# EAGLE design DC_Sensor_ESP8266_ADC_NC_10 (EAGLE 7.5.0)
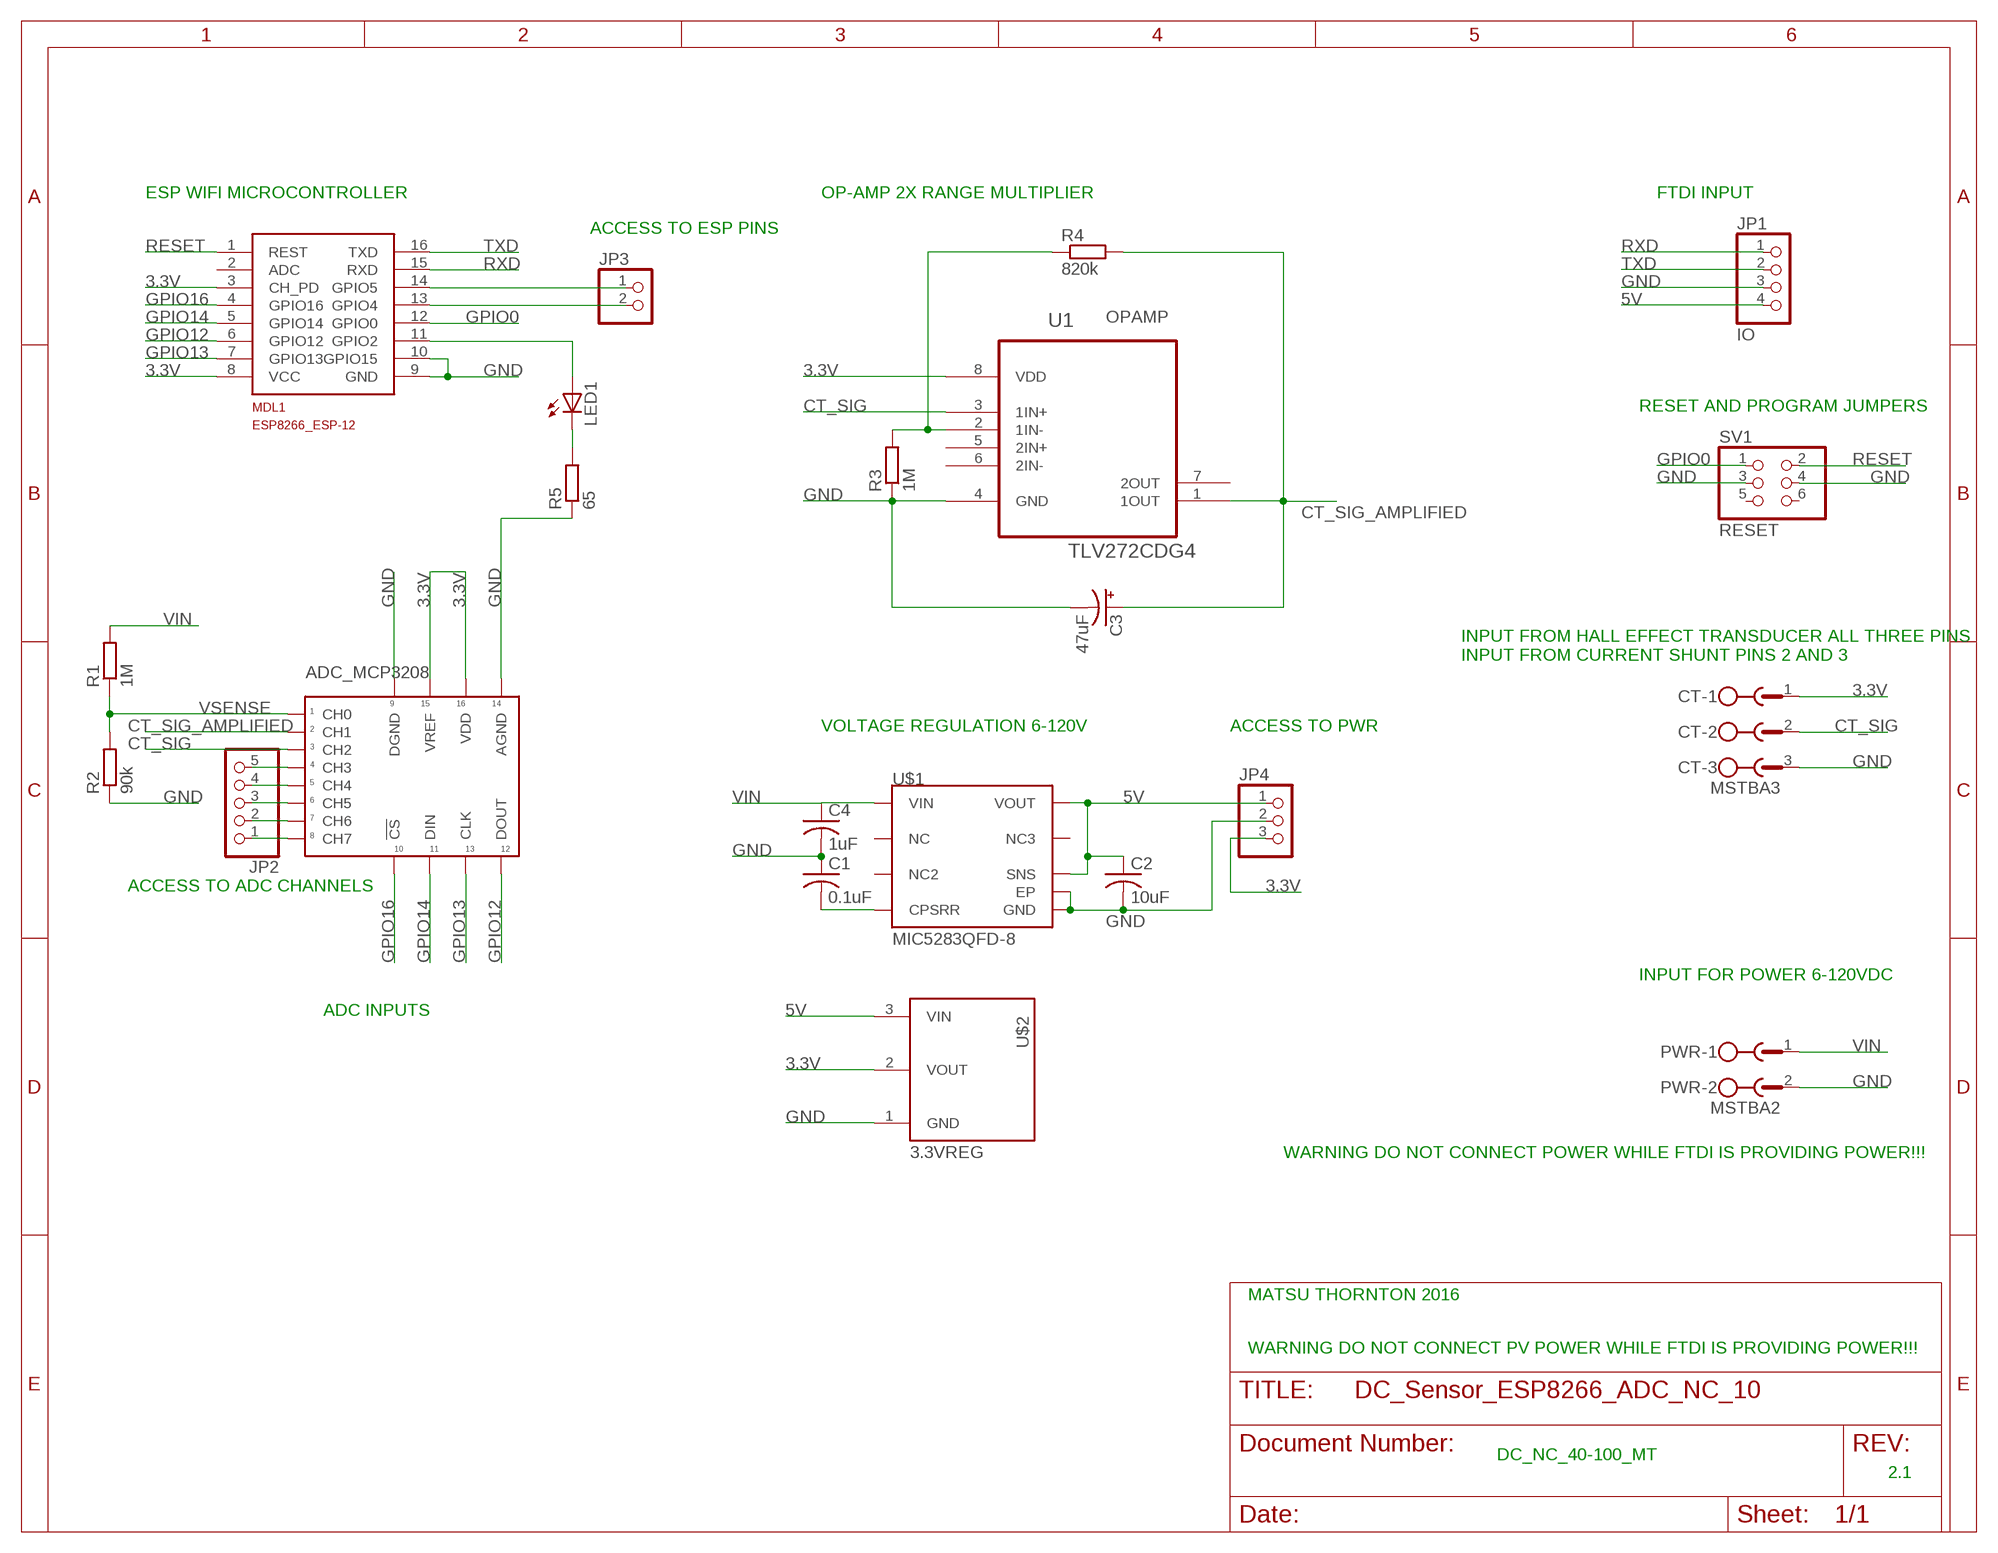
[diagram p0: schematic, sheet 1]

## Parts
ADC_MCP3208  21298ESMD  [PDIP16]
C1  0.1uF  C-USC0402  [C0402]
C2  10uF  C-USC0603K  [C0603K]
C3  47uF  CPOL-USC  [PANASONIC_C]
C4  1uF  C-USC2220K  [C2220K]
CT  MSTBA3  [MSTBA3]
JP1  IO  PINHD-1X4  [1X04]
JP2  PINHD-1X5  [1X05]
JP3  PINHD-1X2  [1X02]
JP4  PINHD-1X3  [1X03]
LED1  LEDCHIP-LED0603  [CHIP-LED0603]
MDL1  ESP8266-12GPIO04/05_CORRECTED  [ESP8266-ESP12]
PWR  MSTBA2  [MSTBA2]
R1  1M  R-EU_R0805  [R0805]
R2  90k  R-EU_R0805  [R0805]
R3  1M  R-EU_R0805  [R0805]
R4  820k  R-EU_R0805  [R0805]
R5  65  R-EU_R0805  [R0805]
SV1  RESET  PINHD-2X3  [2X03]
U1  TLV272CDG4  [SOIC127P600X175-8N]
U$1  MIC5283QFD-8  [8-VDFN]
U$2  3.3VREG  [3PVREG]

## Nets
3.3V: ADC_MCP3208.P$15(VREF) ADC_MCP3208.P$16(VDD) CT.1 JP4.3 MDL1.3(CH_PD) MDL1.8(VCC) U1.8(VDD) U$2.2(VOUT)
5V: C2.1 JP1.4 JP4.1 U$1.P$6(SNS) U$1.P$8(VOUT) U$2.3(VIN)
CT_SIG: ADC_MCP3208.P$3(CH2) CT.2 U1.3(1IN+)
CT_SIG_AMPLIFIED: ADC_MCP3208.P$2(CH1) C3.+ R4.2 U1.1(1OUT)
GND: ADC_MCP3208.P$9(DGND) ADC_MCP3208.P$14(AGND) C1.1 C2.2 C3.- C4.2 CT.3 JP1.3 JP4.2 MDL1.9(GND) MDL1.10(GPIO15) PWR.2 R2.1 R3.1 R5.1 SV1.3 SV1.4 U1.4(GND) U$1.EXP(EP) U$1.P$5(GND) U$2.1(GND)
GPIO0: MDL1.12(GPIO0) SV1.1
GPIO12: ADC_MCP3208.P$12(DOUT) MDL1.6(GPIO12)
GPIO13: ADC_MCP3208.P$13(CLK) MDL1.7(GPIO13)
GPIO14: ADC_MCP3208.P$11(DIN) MDL1.5(GPIO14)
GPIO16: ADC_MCP3208.P$10(!CS) MDL1.4(GPIO16)
N$1: LED1.A MDL1.11(GPIO2)
N$2: R3.2 R4.1 U1.2(1IN-)
N$3: LED1.C R5.2
N$4: C1.2 U$1.P$4(CPSRR)
N$7: JP3.1 MDL1.14(GPIO5)
N$8: JP3.2 MDL1.13(GPIO4)
N$9: ADC_MCP3208.P$4(CH3) JP2.5
N$10: ADC_MCP3208.P$5(CH4) JP2.4
N$11: ADC_MCP3208.P$6(CH5) JP2.3
N$12: ADC_MCP3208.P$7(CH6) JP2.2
N$13: ADC_MCP3208.P$8(CH7) JP2.1
RESET: MDL1.1(REST) SV1.2
RXD: JP1.1 MDL1.15(RXD)
TXD: JP1.2 MDL1.16(TXD)
VIN: C4.1 PWR.1 R1.2 U$1.P$1(VIN)
VSENSE: ADC_MCP3208.P$1(CH0) R1.1 R2.2
Unconnected: MDL1.2(ADC) SV1.5 SV1.6 U1.5(2IN+) U1.6(2IN-) U1.7(2OUT) U$1.P$2(NC) U$1.P$3(NC2) U$1.P$7(NC3)

## Notes on the sheet
- ESP WIFI MICROCONTROLLER | OP-AMP 2X RANGE MULTIPLIER | FTDI INPUT
- ACCESS TO ESP PINS
- RESET AND PROGRAM JUMPERS
- INPUT FROM HALL EFFECT TRANSDUCER ALL THREE PINS
  INPUT FROM CURRENT SHUNT PINS 2 AND 3
- VOLTAGE REGULATION 6-120V | ACCESS TO PWR
- ACCESS TO ADC CHANNELS
- INPUT FOR POWER 6-120VDC
- ADC INPUTS
- WARNING DO NOT CONNECT POWER WHILE FTDI IS PROVIDING POWER!!!
- MATSU THORNTON 2016
- WARNING DO NOT CONNECT PV POWER WHILE FTDI IS PROVIDING POWER!!!
- DC_NC_40-100_MT
- 2.1

## Library data of the parts
ADC_MCP3208 = MCP3208:21298E
C1 = rcl:C-US: CAPACITOR, American symbol; MFG#: GRM155R71C104KA88J
C2 = rcl:C-US: CAPACITOR, American symbol
C3 = rcl:CPOL-US: POLARIZED CAPACITOR, American symbol
C4 = rcl:C-US: CAPACITOR, American symbol; MFG#: C5750X7R2E105M230KA
CT = con-phoenix-508:MSTBA3: PHOENIX; MF: FARNELL; MPN: 1757255; OC_FARNELL: 3705183; OC_NEWARK: 71C4162
JP1 = pinhead:PINHD-1X4: PIN HEADER
JP2 = pinhead:PINHD-1X5: PIN HEADER
JP3 = pinhead:PINHD-1X2: PIN HEADER
JP4 = pinhead:PINHD-1X3: PIN HEADER
LED1 = led:LED: LED OSRAM: - CHIPLED LG R971, LG N971, LY N971, LG Q971, LY Q971, LO R971, LY R971 LH N974, LH R974 LS Q976, LO Q976, LY Q976 LO Q996 - Hyper CHIPLED LW Q18S LB Q993, LB Q99A, LB R99A - SideLED LS A670, LO A670, LY A670, LG A670, LP A670 LB A673, LV A673, LT A673, LW A673 LH A674 LY A675 LS A676, LA A676, LO A676, LY A676, LW A676 LS A679, LY A679, LG A679 - Hyper Micro SIDELED® LS Y876, LA Y876, LO Y876, LY Y876 LT Y87S - SmartLED LW L88C, LW L88S LB L89C, LB L89S, LG L890 LS L89K, LO L89K, LY L89K LS L896, LA L896, LO L896, LY L896 - TOPLED LS T670, LO T670, LY T670, LG T670, LP T670 LSG T670, LSP T670, LSY T670, LOP T670, LYG T670 LG T671, LOG T671, LSG T671 LB T673, LV T673, LT T673, LW T673 LH T674 LS T676, LA T676, LO T676, LY T676, LB T676, LH T676, LSB T676, LW T676 LB T67C, LV T67C, LT T67C, LS T67K, LO T67K, LY T67K, LW E67C LS E67B, LA E67B, LO E67B, LY E67B, LB E67C, LV E67C, LT E67C LW T67C LS T679, LY T679, LG T679 LS T770, LO T770, LY T770, LG T770, LP T770 LB T773, LV T773, LT T773, LW T773 LH T774 LS E675, LA E675, LY E675, LS T675 LS T776, LA T776, LO T776, LY T776, LB T776 LHGB T686 LT T68C, LB T68C - Hyper Mini TOPLED® LB M676 - Mini TOPLED Santana® LG M470 LS M47K, LO M47K, LY M47K Source: http://www.osram.convergy.de LUXEON: - LUMILED® LXK2-PW12-R00, LXK2-PW12-S00, LXK2-PW14-U00, LXK2-PW14-V00 LXK2-PM12-R00, LXK2-PM12-S00, LXK2-PM14-U00 LXK2-PE12-Q00, LXK2-PE12-R00, LXK2-PE12-S00, LXK2-PE14-T00, LXK2-PE14-U00 LXK2-PB12-K00, LXK2-PB12-L00, LXK2-PB12-M00, LXK2-PB14-N00, LXK2-PB14-P00, LXK2-PB14-Q00 LXK2-PR12-L00, LXK2-PR12-M00, LXK2-PR14-Q00, LXK2-PR14-R00 LXK2-PD12-Q00, LXK2-PD12-R00, LXK2-PD12-S00 LXK2-PH12-R00, LXK2-PH12-S00 LXK2-PL12-P00, LXK2-PL12-Q00, LXK2-PL12-R00 Source: www.luxeon.com KINGBRIGHT: KA-3528ASYC Source: www.kingbright.com
MDL1 = ESP8266-ESP12:ESP8266-12: Espressif ESP8266 ESP-12 Module with GPIO04 and GPIO05 corrected.
PWR = con-phoenix-508:MSTBA2: PHOENIX; MF: FARNELL; MPN: 1757242; OC_FARNELL: 3705171; OC_NEWARK: 71C4161
R1-R5 = rcl:R-EU_: RESISTOR, European symbol
SV1 = pinhead:PINHD-2X3: PIN HEADER
U1 = Texas Instruments_By_element14_Batch_1:TLV272CDG4: OPERATIONAL AMPLIFIERS; MPN: TLV272CDG4; OC_FARNELL: 1234856; OC_NEWARK: 13M5572; PACKAGE: SOIC-8; SUPPLIER: TI; TYPE: OPAMP
U$1 = vreg:MIC5283: MIC5283 Linear Voltage Regulators 120V/150mA Low PSSR Linear Regulator
U$2 = vreg2:3.3VREG: This is the standard type of 3.3V regulator that Holm and I have been using. It has three pins vin, vout, and ground with standard pin header spacing.

## Board
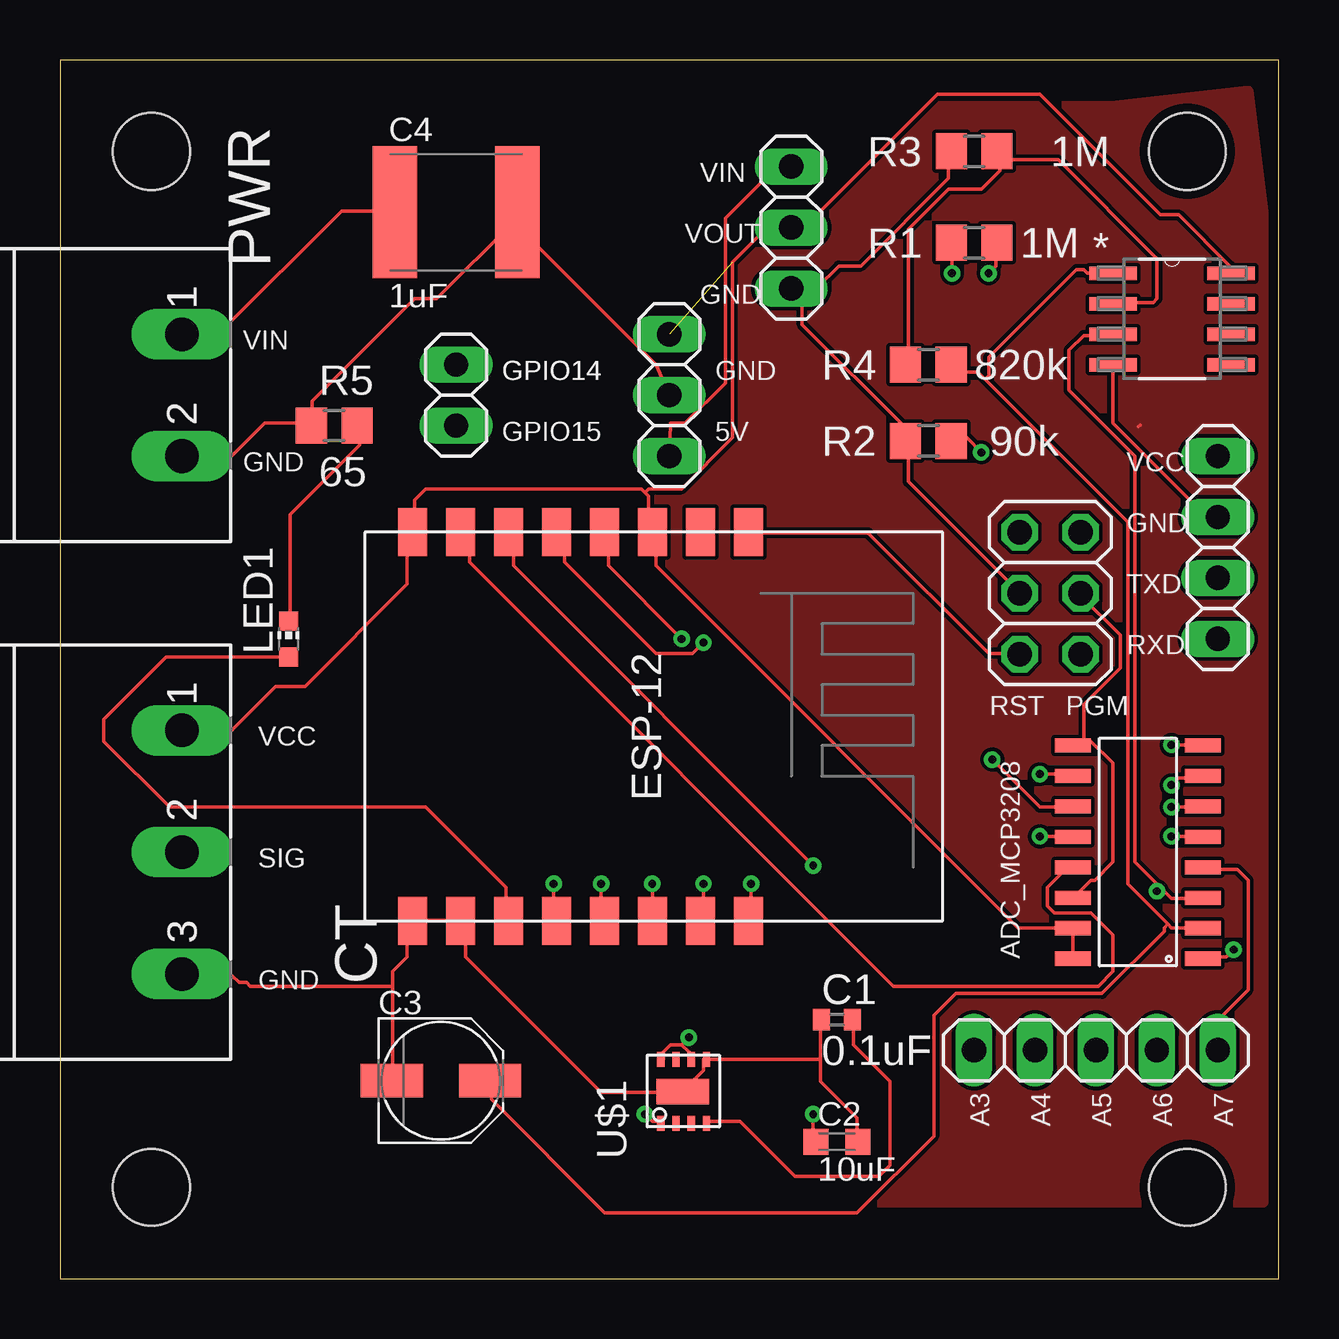
[diagram p1: board, top side]
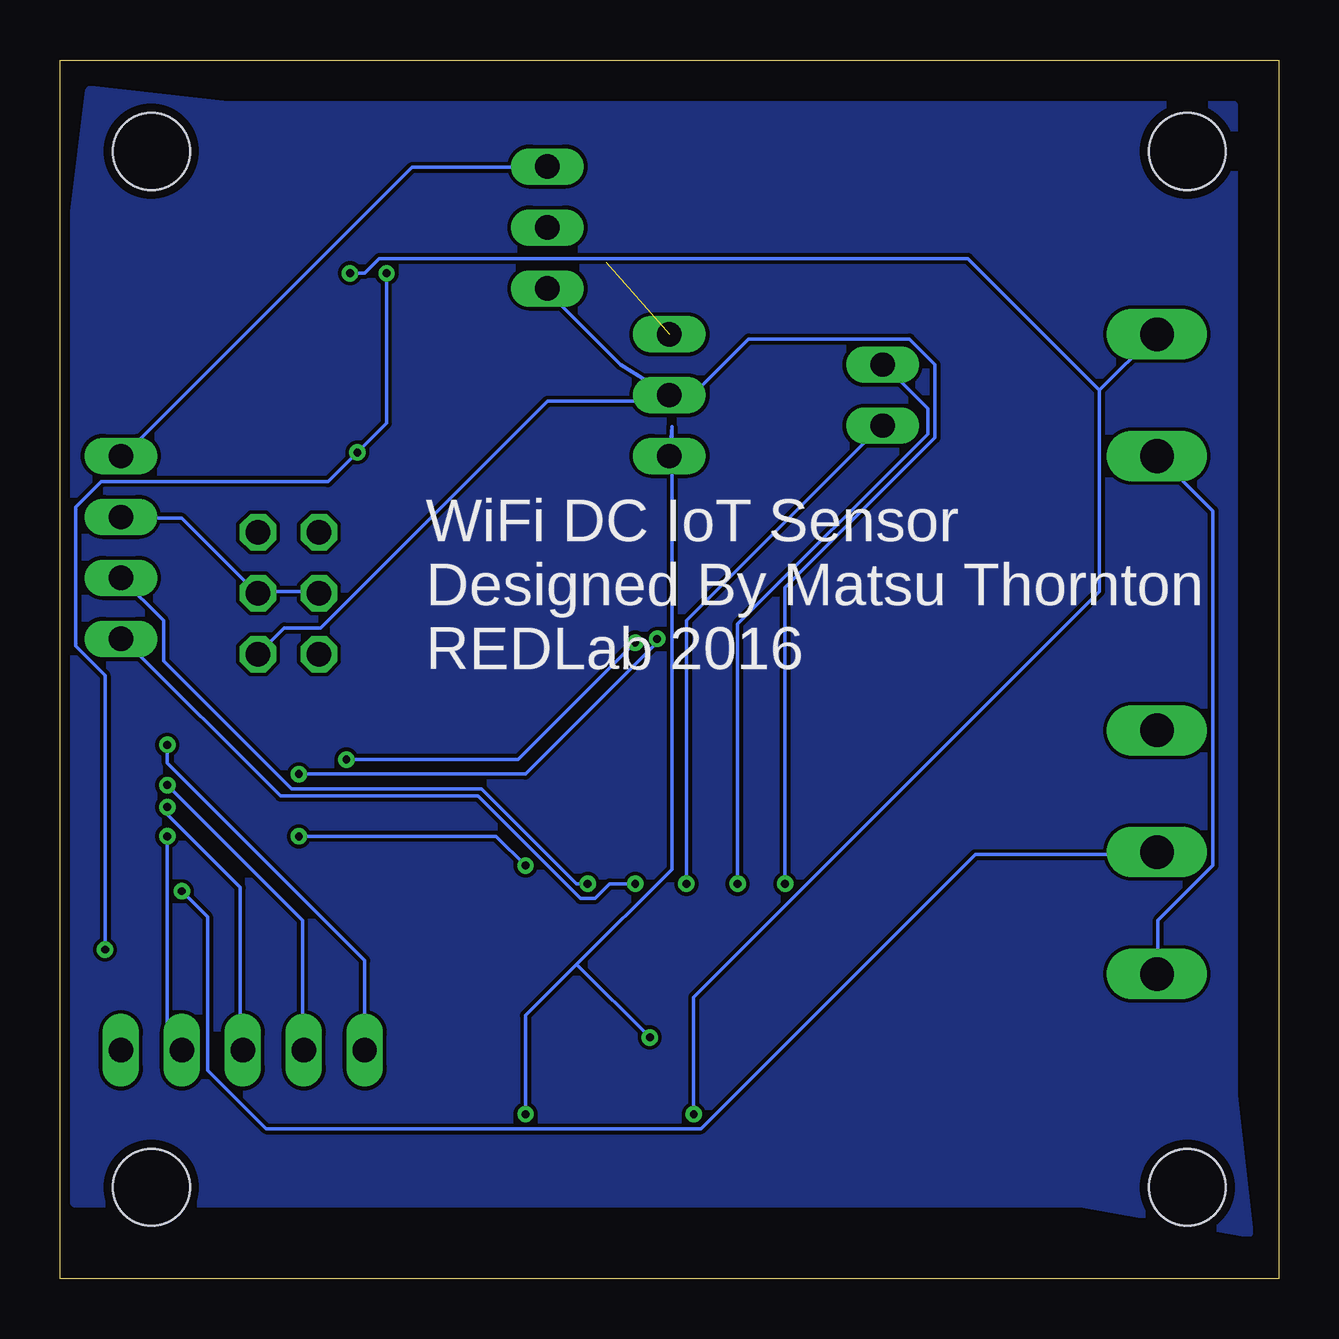
[diagram p2: board, bottom side, seen from below]

Size 50.8 x 50.8 mm. Coordinates in mm from the lower left corner, seen from the top.
Outline: 0,0 50.8,0 50.8,50.8 0,50.8 0,0
Copper layers (1*16): Top 0.0356mm / dielectric 1.5011mm / Bottom 0.0356mm
Design rules "LaenPCBOrder": minimum track width 6mil, minimum drill 13mil, track to track 6mil, track to pad 6mil, pad to pad 6mil, via to via 6mil, smd to smd 6mil, copper to edge 15mil, drill to drill 6mil, minimum pad ring 7mil, minimum via ring 7mil, stop-mask expansion 3mil, vias tented up to drill 0mil, thermal gap 10mil
Holes 3.2 mm at 3.81,46.99 46.99,46.99 46.99,3.81 3.81,3.81

### Footprints (pad centres in the part's own frame; a part is rotated, then mirrored left to right if it is on the bottom)
PDIP16 = smd 0.6 x 1.5: P$1 0,0; P$2 1.27,0; P$3 2.54,0; P$4 3.81,0; P$5 5.08,0; P$6 6.35,0; P$7 7.62,0; P$8 8.89,0; P$9 8.89,5.4; P$10 7.62,5.4; P$11 6.35,5.4; P$12 5.08,5.4; P$13 3.81,5.4; P$14 2.54,5.4; P$15 1.27,5.4; P$16 0,5.4
C0402 = smd 0.7 x 0.9: 1 -0.65,0; 2 0.65,0
C0603K = smd 1.05 x 1.08: 1 -0.875,0; 2 0.875,0
PANASONIC_C = smd 2.6 x 1.4: + 2.05,0; - -2.05,0
C2220K = smd 1.85 x 5.5: 1 -2.55,0; 2 2.55,0
MSTBA3 = drill 1.397 long: 1 -5.08,5.08; 2 0,5.08; 3 5.08,5.08
1X04 = drill 1.016 long: 1 -3.81,0; 2 -1.27,0; 3 1.27,0; 4 3.81,0
1X05 = drill 1.016 long: 1 -5.08,0; 2 -2.54,0; 3 0,0; 4 2.54,0; 5 5.08,0
1X02 = drill 1.016 long: 1 -1.27,0; 2 1.27,0
1X03 = drill 1.016 long: 1 -2.54,0; 2 0,0; 3 2.54,0
CHIP-LED0603 = smd 0.8 x 0.8: A 0,-0.75; C 0,0.75
ESP8266-ESP12 = smd 2 x 1.2: 1 0,16; 2 0,14; 3 0,12; 4 0,10; 5 0,8; 6 0,6; 7 0,4; 8 0,2; 9 16.2,2; 10 16.2,4; 11 16.2,6; 12 16.2,8; 13 16.2,10; 14 16.2,12; 15 16.2,14; 16 16.2,16
MSTBA2 = drill 1.397 long: 1 -2.54,5.08; 2 2.54,5.08
R0805 = smd 1.3 x 1.5: 1 -0.95,0; 2 0.95,0
2X03 = drill 1.016 octagon: 1 -2.54,-1.27; 2 -2.54,1.27; 3 0,-1.27; 4 0,1.27; 5 2.54,-1.27; 6 2.54,1.27
SOIC127P600X175-8N = smd 1.981 x 0.559: 1 -2.464,1.905; 2 -2.464,0.635; 3 -2.464,-0.635; 4 -2.464,-1.905; 5 2.464,-1.905; 6 2.464,-0.635; 7 2.464,0.635; 8 2.464,1.905
8-VDFN = smd 2.184 x 1.067: EXP 1.194,1.448 | smd 0.305 x 0.61: P$1 0.279,0.127; P$2 0.914,0.127; P$3 1.549,0.127; P$4 2.184,0.127; P$5 2.184,2.794; P$6 1.549,2.794; P$7 0.914,2.794; P$8 0.279,2.794
3PVREG = drill 1.016 long: 1 -2.54,0; 2 0,0; 3 2.54,0

### Placement (x,y rotation side)
ADC_MCP3208  47.62,13.34 90 top
C1  32.38,10.79 0 top
C2  32.38,5.71 0 top
C3  15.88,8.26 0 top
C4  16.51,44.45 0 top
CT  0,17.78 270 top
JP1  48.26,30.48 90 top
JP2  43.18,9.53 0 top
JP3  16.51,36.83 90 top
JP4  25.4,36.83 90 top
LED1  9.53,26.67 0 top
MDL1  12.7,31.11 270 top
PWR  0,36.83 270 top
R1  38.1,43.18 0 top
R2  36.2,34.92 0 top
R3  38.1,46.99 0 top
R4  36.2,38.1 0 top
R5  11.43,35.56 0 top
SV1  41.27,28.57 90 top
U1  46.35,40.01 0 top
U$1  24.77,6.35 0 top
U$2  30.48,43.81 90 top

### Tracks (layer width: path | path; a pad name or v marks a point on that pad's centre or on a via)
3.3V  (1 unrouted)
  Top 0.152: U1.8 48.77,41.91 48.77,42.22 46.63,44.35 45.87,44.35 40.84,49.38 36.58,49.38 31.09,43.89 30.48,43.89 U$2.2 30.48,43.74 29.41,43.74 28.04,42.37 28.04,35.05 25.91,32.92 24.54,32.92 24.38,32.77 | ADC_MCP3208.P$16 42.22,13.41 42.22,14.48 ADC_MCP3208.P$15 42.22,14.63 39.93,14.63 24.84,29.72 24.84,31.09 MDL1.3 24.69,31.24 24.54,31.39 24.54,32.61 24.38,32.77 | 24.38,32.77 24.23,32.92 15.24,32.92 14.78,32.46 14.78,31.24 MDL1.8 14.63,31.09 14.48,30.94 14.48,28.96 10.21,24.69 8.99,24.69 7.16,22.86 CT.1
5V  (via drill 0.33)
  Top 0.152: 25.91,9.75 25.45,9.75 25.15,9.45 25.15,9.14 U$1.P$8 | 25.91,9.75 26.21,9.45 26.21,9.14 U$1.P$6 | v31.39,6.86 31.39,5.79 C2.1 | v26.21,10.06 25.91,9.75 | U$2.3 30.48,46.33 29.87,46.33 27.74,44.2 27.74,37.34 26.06,35.66 25.45,35.66 JP4.1
  Bottom 0.152: U$2.3 30.48,46.33 36.12,46.33 48.16,34.29 JP1.4 | v31.39,6.86 31.39,10.97 29.26,13.11 | 29.26,13.11 25.3,17.07 25.3,35.51 JP4.1 | 29.26,13.11 v26.21,10.06
CT_SIG  (via drill 0.33)
  Top 0.152: 45.87,16.31 44.81,17.37 44.81,34.29 42.06,37.03 42.06,38.71 42.67,39.32 43.89,39.32 U1.3 | 45.87,16.31 46.33,15.85 47.55,15.85 ADC_MCP3208.P$3 | 45.87,16.31 v45.72,16.15
  Bottom 0.152: v45.72,16.15 44.65,15.09 44.65,8.69 42.22,6.25 24.08,6.25 12.65,17.68 5.18,17.68 CT.2
CT_SIG_AMPLIFIED
  Top 0.152: 46.18,14.78 44.5,16.46 44.5,31.55 38.56,37.49 | 46.18,14.78 46.33,14.63 47.55,14.63 ADC_MCP3208.P$2 | 38.56,37.49 38.25,37.8 37.49,37.8 37.19,38.1 R4.2 | U1.1 42.82,41.91 42.67,42.06 42.37,42.06 38.71,38.41 38.71,37.64 38.56,37.49 | 46.18,14.78 46.02,14.63 46.02,14.48 43.43,11.89 37.34,11.89 36.42,10.97 36.42,5.94 33.22,2.74 22.71,2.74 17.98,7.47 17.98,8.23 C3.+
GND
  Top 0.152: 31.7,9.14 31.7,8.23 33.22,6.71 33.22,5.79 C2.2 | 31.7,9.14 31.7,10.67 C1.1 | 31.7,9.14 U$1.P$5 26.82,9.14 26.82,8.69 26.06,7.92 U$1.EXP 25.91,7.77 22.55,7.77 16.92,13.41 16.92,14.63 16.76,14.78 MDL1.10 16.61,14.94 14.78,14.94 MDL1.9 14.63,14.78 14.48,14.63 14.48,13.41 13.87,12.8 13.87,12.19 | 13.87,12.19 13.87,8.38 C3.- | 13.87,12.19 7.92,12.19 7.77,12.34 7.47,12.34 7.16,12.65 5.18,12.65 CT.3 | PWR.2 7.16,34.29 8.53,35.66 10.36,35.66 R5.1 10.52,35.66 10.52,36.58 14.78,40.84 15.7,40.84 18.9,44.04 | 18.9,44.04 19.2,44.35 C4.2 18.9,44.04 | 30.94,41.3 30.48,41.3 U$2.1 30.94,41.3 | 30.94,41.3 31.55,41.3 32.46,42.22 33.38,42.22 37.03,45.87 37.03,46.94 R3.1 | U1.4 43.89,35.66 47.7,31.85 48.16,31.85 JP1.3 | 42.67,22.4 42.52,22.4 42.37,22.25 ADC_MCP3208.P$9 42.67,22.4 | 42.67,22.4 42.98,22.4 43.89,21.49 43.89,17.37 43.13,16.61 42.98,16.61 42.37,16 ADC_MCP3208.P$14 | SV1.4 35.36,33.22 35.36,34.9 R2.1 35.2,35.05 35.2,35.51 30.94,39.78 30.94,41.3 | 42.67,22.4 42.67,23.93 44.2,25.45 44.2,26.82 42.52,28.5 SV1.3 | 18.9,44.04 24.84,38.1 JP4.2
  Bottom 0.152: JP4.2 27.43,38.1 30.48,41.15 U$2.1 | SV1.4 40.08,28.65 42.52,28.65 SV1.3 42.67,28.65 45.72,31.7 48.16,31.7 JP1.3 | CT.3 5.03,12.8 5.03,14.94 2.74,17.22 2.74,32 5.03,34.29 PWR.2
GPIO0  (via drill 0.33)
  Top 0.152: v20.57,16.46 20.57,14.94 MDL1.12
  Bottom 0.152: v20.57,16.46 20.57,28.8 14.33,35.05 14.33,38.1 15.39,39.17 22.1,39.17 24.69,36.58 30.48,36.58 39.93,27.13 41.45,27.13 SV1.1
GPIO12  (via drill 0.33)
  Top 0.152: v40.84,18.44 42.22,18.44 ADC_MCP3208.P$12 | v31.39,17.22 18.9,29.72 18.9,30.94 18.75,31.09 MDL1.6
  Bottom 0.152: v40.84,18.44 32.61,18.44 v31.39,17.22
GPIO13
  Top 0.152: ADC_MCP3208.P$13 42.22,17.07 41.91,17.07 41.15,16.31 41.15,15.54 41.45,15.24 42.98,15.24 43.89,14.33 43.89,12.8 43.28,12.19 34.75,12.19 17.07,29.87 17.07,30.79 16.76,31.09 MDL1.7
GPIO14  (via drill 0.33)
  Top 0.152: v38.86,21.64 40.84,19.66 42.22,19.66 ADC_MCP3208.P$11 | v26.82,26.52 26.36,26.06 24.84,26.06 21.03,29.87 21.03,30.79 20.73,31.09 MDL1.5
  Bottom 0.152: v38.86,21.64 31.7,21.64 v26.82,26.52
GPIO16  (via drill 0.33)
  Top 0.152: v40.84,21.03 42.22,21.03 ADC_MCP3208.P$10 | v25.91,26.67 22.86,29.72 22.86,30.94 22.71,31.09 MDL1.4
  Bottom 0.152: v40.84,21.03 31.39,21.03 25.91,26.52 v25.91,26.67
N$1
  Top 0.152: LED1.A 9.45,25.91 4.42,25.91 1.83,23.32 1.83,22.4 4.57,19.66 15.24,19.66 18.59,16.31 18.59,14.94 MDL1.11
N$2
  Top 0.152: 39.17,46.63 39.17,46.94 R3.2 39.17,46.63 | 39.17,46.63 39.17,46.18 38.41,45.41 37.03,45.41 35.36,43.74 35.36,38.1 R4.1 | 39.17,46.63 41.6,46.63 45.72,42.52 45.72,40.84 45.57,40.69 43.89,40.69 U1.2
N$3
  Top 0.152: LED1.C 9.6,27.43 9.6,31.85 12.5,34.75 12.5,35.51 R5.2
N$4
  Top 0.152: U$1.P$4 26.98,6.55 28.35,6.55 30.63,4.27 34.14,4.27 34.59,4.72 34.59,8.23 33.07,9.75 33.07,10.67 C1.2
N$5
  Top 0.152: 44.96,35.51 45.03,35.59
  pour Top: 1.91,48.9 43.81,48.9 49.53,49.53 50.16,44.45 50.16,3.17 9.53,3.17 9.53,3.81 7.62,3.81 1.91,1.91
N$6
  pour Bottom: 43.81,48.9 1.91,48.9 1.91,7.62 1.27,1.91 8.26,3.17 50.16,3.17 50.16,44.45 49.53,49.53
N$7  (via drill 0.33)
  Top 0.152: v24.69,16.46 24.69,14.94 MDL1.14
  Bottom 0.152: v24.69,16.46 24.69,27.43 16.61,35.51 JP3.1
N$8  (via drill 0.33)
  Top 0.152: v22.55,16.46 22.55,14.94 MDL1.13
  Bottom 0.152: v22.55,16.46 22.55,27.28 14.63,35.2 14.63,36.27 16.46,38.1 JP3.2
N$9
  Top 0.152: ADC_MCP3208.P$4 47.7,17.07 49.07,17.07 49.53,16.61 49.53,12.04 48.31,10.82 48.31,9.6 JP2.5
N$10  (via drill 0.33)
  Top 0.152: v46.33,18.44 47.55,18.44 ADC_MCP3208.P$5
  Bottom 0.152: v46.33,18.44 46.33,10.21 45.72,9.6 JP2.4
N$11  (via drill 0.33)
  Top 0.152: v46.33,19.66 47.55,19.66 ADC_MCP3208.P$6
  Bottom 0.152: v46.33,19.66 46.33,19.36 43.28,16.31 43.28,9.6 JP2.3
N$12  (via drill 0.33)
  Top 0.152: v46.33,20.57 46.63,20.88 47.55,20.88 ADC_MCP3208.P$7
  Bottom 0.152: v46.33,20.57 40.69,14.94 40.69,9.6 JP2.2
N$13  (via drill 0.33)
  Top 0.152: v46.33,22.25 47.55,22.25 ADC_MCP3208.P$8
  Bottom 0.152: v46.33,22.25 46.33,21.49 38.1,13.26 JP2.1
RESET
  Top 0.152: MDL1.1 28.8,31.09 33.68,31.09 38.71,26.06 39.93,26.06 SV1.2
RXD  (via drill 0.33)
  Top 0.152: v26.82,16.46 26.82,14.94 MDL1.15
  Bottom 0.152: v26.82,16.46 27.89,16.46 28.5,15.85 29.11,15.85 33.38,20.12 41.6,20.12 48.16,26.67 JP1.1
TXD  (via drill 0.33)
  Top 0.152: v28.8,16.46 28.8,14.94 MDL1.16
  Bottom 0.152: v28.8,16.46 29.26,16.46 33.22,20.42 41.15,20.42 46.48,25.76 46.48,27.43 JP1.2
VIN  (via drill 0.33)
  Top 0.152: v24.38,6.86 24.69,6.55 24.99,6.55 U$1.P$1 | v38.71,41.91 39.01,42.22 39.01,43.13 R1.2 | C4.1 13.87,44.5 11.73,44.5 6.71,39.47 5.18,39.47 PWR.1
  Bottom 0.152: v24.38,6.86 24.38,11.73 7.47,28.65 7.47,37.03 | 7.47,37.03 5.18,39.32 PWR.1 | v38.71,41.91 38.1,41.91 37.49,42.52 12.95,42.52 7.47,37.03
VSENSE  (via drill 0.33)
  Top 0.152: v48.92,13.72 48.62,13.41 47.7,13.41 ADC_MCP3208.P$1 | v38.41,34.44 37.8,35.05 37.19,35.05 R2.2 | v37.19,41.91 37.19,43.13 R1.1
  Bottom 0.152: v48.92,13.72 48.92,25.15 50.14,26.36 50.14,32.16 49.07,33.22 39.62,33.22 v38.41,34.44 37.19,35.66 v37.19,41.91

### Text on the board
bPlace: WiFi DC IoT Sensor / Designed By Matsu Thornton / REDLab 2016
tNames: VIN | VOUT | GND | VIN | GPIO14 | GPIO14 | GND | GPIO15 | 5V | GND | VCC | GND | TXD | RXD | RST | PGM | VCC | SIG | GND | A3 | A4 | A5 | A6 | A7